# Altium schematic sheet Top_level.SchDoc
size A; SheetNumber: 1; SheetTotal: 2
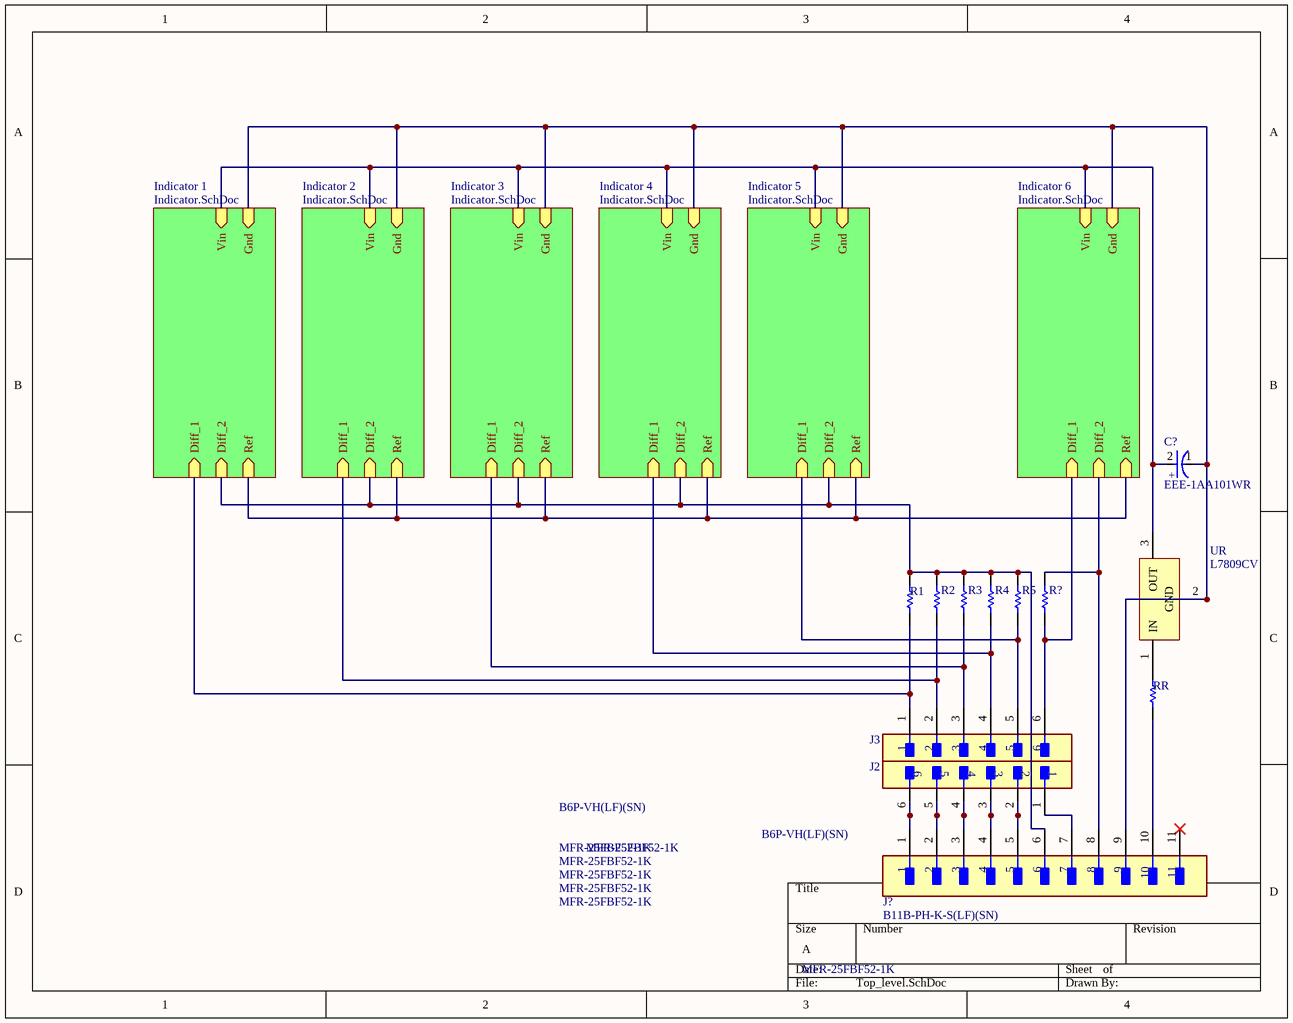
[diagram p0: Top_level.SchDoc]

## Parts
C?  EEE-1AA101WR  [FP-SC-MFG]
J2  B6P-VH(LF)(SN)  [FP-B6P-VH_LF_SN-MFG]
J3  B6P-VH(LF)(SN)  [FP-B6P-VH_LF_SN-MFG]
J?  B11B-PH-K-S(LF)(SN)  [FP-B11B-PH-K-S_LF_SN-MFG]
R1  MFR-25FBF52-1K  [RESA60-630X240]
R2  MFR-25FBF52-1K  [RESA60-630X240]
R3  MFR-25FBF52-1K  [RESA60-630X240]
R4  MFR-25FBF52-1K  [RESA60-630X240]
R5  MFR-25FBF52-1K  [RESA60-630X240]
R?  MFR-25FBF52-1K  [RESA60-630X240]
RR  MFR-25FBF52-1K  [RESA60-630X240]
UR  L7809CV  [TO220]

## Sub-sheets
Indicator 1  = Indicator.SchDoc: Vin (in), Diff_1 (in), Diff_2 (in), Ref (in), Gnd (in)
Indicator 2 = Indicator.SchDoc: Vin (in), Diff_1 (in), Diff_2 (in), Ref (in), Gnd (in)
Indicator 3 = Indicator.SchDoc: Vin (in), Diff_1 (in), Diff_2 (in), Ref (in), Gnd (in)
Indicator 4 = Indicator.SchDoc: Vin (in), Diff_1 (in), Diff_2 (in), Ref (in), Gnd (in)
Indicator 5 = Indicator.SchDoc: Vin (in), Diff_1 (in), Diff_2 (in), Ref (in), Gnd (in)
Indicator 6 = Indicator.SchDoc: Vin (in), Diff_1 (in), Diff_2 (in), Ref (in), Gnd (in)

## Nets
NetC?_1: C?.1(C) J?.9 UR.2(GND) ; sheet Indicator 1 /Gnd, sheet Indicator 2/Gnd, sheet Indicator 3/Gnd, sheet Indicator 4/Gnd, sheet Indicator 5/Gnd, sheet Indicator 6/Gnd
NetC?_2: C?.2(A) UR.3(OUT) ; sheet Indicator 1 /Vin, sheet Indicator 2/Vin, sheet Indicator 3/Vin, sheet Indicator 4/Vin, sheet Indicator 5/Vin, sheet Indicator 6/Vin
NetJ2_1: J2.1 J?.7
NetJ2_2: J2.2 J?.5
NetJ2_3: J2.3 J?.4
NetJ2_4: J2.4 J?.3
NetJ2_5: J2.5 J?.2
NetJ2_6: J2.6 J?.1
NetJ3_1: J3.1 R1.2 ; sheet Indicator 1 /Diff_1
NetJ3_2: J3.2 R2.2 ; sheet Indicator 2/Diff_1
NetJ3_3: J3.3 R3.2 ; sheet Indicator 3/Diff_1
NetJ3_4: J3.4 R4.2 ; sheet Indicator 4/Diff_1
NetJ3_5: J3.5 R5.2 ; sheet Indicator 5/Diff_1
NetJ3_6: J3.6 R?.2 ; sheet Indicator 6/Diff_1
NetJ?_6: J?.6 R1.1 R2.1 R3.1 R4.1 R5.1 ; sheet Indicator 1 /Diff_2, sheet Indicator 2/Diff_2, sheet Indicator 3/Diff_2, sheet Indicator 4/Diff_2, sheet Indicator 5/Diff_2
NetJ?_8: J?.8 R?.1 ; sheet Indicator 6/Diff_2
NetJ?_10: J?.10 RR.2
NetRR_1: RR.1 UR.1(IN)
(unnamed): sheet Indicator 1 /Ref, sheet Indicator 2/Ref, sheet Indicator 3/Ref, sheet Indicator 4/Ref, sheet Indicator 5/Ref, sheet Indicator 6/Ref

Not connected (* = marked no-connect by the designer): J? 11*

## Notes on the sheet
- (in symbol CMP-05427-000047-1) +

## Library data of the parts
C? = CMP-05427-000047-1: CAP ALUM 100UF 20% 10V SMD; Life (Hours): 1000Hour; Ripple Current: 50mA; Packaging: Tape and Reel; Diameter: 5mm; Voltage Rating (DC): 10V; Mount: Surface Mount; Max Operating Temperature: 85°C; Length: 5.5mm; Case/Package: Radial; Height: 5.4mm; Construction: Cylindrical; Termination: SMD/SMT; Height - Seated (Max): 0.213inch; Series: S; Min Operating Temperature: -40°C; Capacitance: 100uF; Tolerance: 20%; Voltage Rating: 10V; Package Quantity: 1; Radiation Hardening: No; Ripple Current (AC): 50mA; Lead Free: Lead Free; RoHS Compliant: Yes; Contact Plating: Tin
J2 J3 = CMP-17439-000380-1: CONN HEADER VERT 6POS 3.96MM; Max Current Rating: 10A; Number of Contacts: 6; Mated Stacking Heights: 16.5mm; Contact Resistance: 20mR; Max Voltage Rating (AC): 250V; Gender: Male; Contact Type: Male Pin; Packaging: Bulk; Insulation Color: Natural; Length: 23.7mm; Orientation: Straight; Color: Natural; Contact Shape: Square; Housing Material: Polyamide; Mount: Through Hole; Max Operating Temperature: 85°C; Pitch: 3.96mm; Number of Positions: 6; Termination: Solder; Height: 8.5mm; Number of Pins: 6; Contact Material: Brass; Current Rating: 10A; Fastening Type: Ramp; Contact Finish - Mating: TIN; Series: VH; Width: 14.6mm; Voltage Rating: 250V; Insulation Material: Nylon; Depth: 8.5mm; Number of Rows: 1; Min Operating Temperature: -25°C; Contact Mating Length: 0.303inch; Lead Free: Lead Free; Flammability Rating: UL94 V-0; Contact Plating: Copper; Housing Color: White; REACH SVHC: No SVHC; Connector Type: Header
J? = CMP-17439-000556-1: CONN HEADER VERT 11POS 2MM; Mated Stacking Heights: 8mm; Contact Resistance: 10mR; Current Rating: 2A; Number of Positions: 11; Voltage Rating (AC): 100V; Insulation Resistance: 1MR; Gender: Male; Termination: Press-Fit; Pitch: 2mm; Contact Plating: Tin; Flammability Rating: UL94 V-0; Contact Finish - Mating: TIN; Lead Pitch: 2mm; Insulation Color: Natural; Housing Color: Natural; Contact Mating Length: 0.13inch; Contact Shape: Square; Height: 9.4mm; Reach SVHC Compliant: Yes; Mount: Through Hole; Color: Natural; Contact Material: Brass; Number of Rows: 1; Voltage Rating: 100V; Connector Type: Header; Contact Type: Male Pin; Fastening Type: Detent; Number of Contacts: 11; Insulation Material: Nylon; Series: PH; Width: 4.5mm; Length: 23.9mm; Working Voltage: 100V; Number of Poles: 11; Lead Free: Lead Free; Packaging: Bulk
R1-R5 R? RR = CMP-1659-00075-1: Axial Resistor, 1 KOhm, +/- 1%, 250 mW, -55 to 155 degC, 2-Pin THD, RoHS, Bulk; Voltage Rating: 250 V; Resistance: 10 kohm; Power Rating: 250 mW; ComponentLink2Description: Datasheet; RoHSCompliant: true; PackageReference: MFR-25; Case\Package: Axial; Max Operating Temperature: 155 degC; DatasheetVersion: Apr-13; Tolerance: 1%; ComponentLink1URL: http://www.yageo.com/; Length: 0.248 inch; ComponentLink2URL: http://www.yageo.com/documents/recent/Yageo%20LR_MFR_2013.pdf; Packaging: Bulk; Package Quantity: 200; PackageDescription: 2-Pin Axial Lead, Dia 2.4 mm, Body Length 6.3 mm; Min Operating Temperature: -55 degC; ComponentLink1Description: Manufacturer URL
UR = CMP-0244-00459-1: Positive Voltage Regulator, 9V, 3-Pin TO-220; ComponentLink3URL: http://www.st.com/internet/com/TECHNICAL_RESOURCES/TECHNICAL_LITERATURE/PACKAGE_INFORMATION/CD00004649.pdf; ComponentLink2Description: Datasheet; DatasheetVersion: 16/11/2011; PackageVersion: ver3.0; PackageDescription: TO, Thru-Hole, Vertical, Heatsink Mounted; 3 In-Line Leads; Pitch 2.54 mm; ComponentLink3Description: Package Specification; ComponentLink2URL: http://www.st.com/internet/com/TECHNICAL_RESOURCES/TECHNICAL_LITERATURE/DATASHEET/CD00000444.pdf; ComponentLink1URL: http://www.st.com; ComponentLink1Description: Manufacturer URL; PackageReference: TO220